# Altium schematic sheet 1.SchDoc
size A2
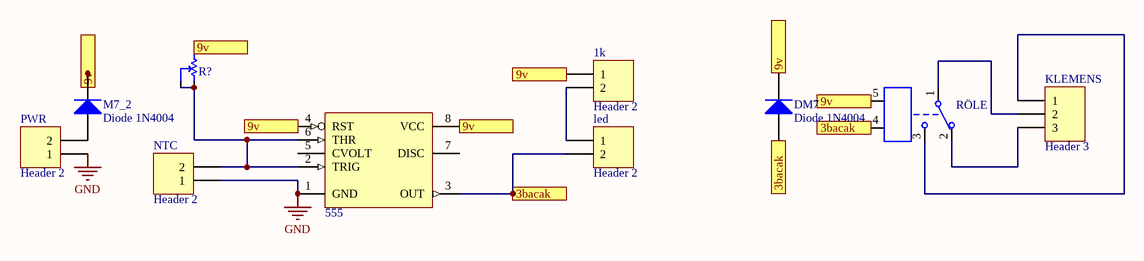
[diagram p0: 1.SchDoc]

## Parts
1k  Header 2  [HDR1X2]
555  (no value)  [SOIC8]
DM7  Diode 1N4004  [DO-41]
KLEMENS  Header 3  [3R 5.08 Geçmeli Klemens]
led  Header 2  [HDR1X2]
M7_2  Diode 1N4004  [DO-41]
NTC  Header 2  [HDR1X2]
PWR  Header 2  [2R 5.08 GEÇMELİ]
R?  10K  [3r 5.08 o nolu]  (value not drawn)
RÖLE  (no value)  [RELAY KUP]

## Ports
3bacak, 9v

## Nets
GND: 555.1(GND) NTC.1 PWR.1
3bacak: 555.3(OUT) DM7.1(A) led.2 RÖLE.4 ; port 3bacak
9v: 1k.1 555.4(RST) 555.8(VCC) DM7.2(K) R?.1 RÖLE.5 ; port 9v
Net1k_2: 1k.2 led.1
Net555_2: 555.2(TRIG) 555.6(THR) NTC.2 R?.2 R?.3
NetKLEMENS_1: KLEMENS.1 RÖLE.3
NetKLEMENS_2: KLEMENS.2 RÖLE.1
NetKLEMENS_3: KLEMENS.3 RÖLE.2
NetM7_2_1: M7_2.1(A) PWR.2

Not connected (* = marked no-connect by the designer): 555 5(CVOLT) 7(DISC); M7_2 2(K)

## Library data of the parts
1k led NTC PWR = Header 2: Header, 2-Pin; LatestRevisionDate: 17-Jul-2002; LatestRevisionNote: Re-released for DXP Platform.; Publisher: Altium Limited
555 = H11IS0001: NE555 IC-555 TIMER SMD SOIC8 ENTEGRE (ST-TEXAS-UTC); Component Name: NE555_SOIC8; Cari: H11IS0001; Type: SMD
DM7 M7_2 = Diode 1N4004: 1 Amp General Purpose Rectifier; Published: 8-Jun-2000; LatestRevisionDate: 17-Jul-2002; LatestRevisionNote: Re-released for DXP Platform.; DatasheetVersion: 1998; PackageVersion: Aug-1999; PackageReference: DO-41; Publisher: Altium Limited; PackageDescription: Diode, Axial; Body 5.2 x 2.7 mm (LxDia. max), Lead Dia. 0.86 mm (max); Code_JEDEC: DO-204-AL; ComponentLink1Description: Manufacturer Link; ComponentLink1URL: http://www.fairchildsemi.com/; ComponentLink2Description: Datasheet; ComponentLink2URL: http://www.fairchildsemi.com/ds/1N%2F1N4001.pdf
KLEMENS = Header 3: Header, 3-Pin; pin to pad: 1>3 3>1; LatestRevisionDate: 17-Jul-2002; LatestRevisionNote: Re-released for DXP Platform.; Publisher: Altium Limited
R? = H11TP0009: Trimpot 10MM 10K Ok Başlı Dik 180°; Component Name: 10K_DIP_POT180°; Cari: H11TP0009; Value: 10K; Type: DIP
RÖLE = H11RL0001: 12V Küp Röle ( TIANBO-QUANJI-ZOFR); Component Name: 12VKUP_DIPROLE; Cari: H11RL0001; Type: DIP